# EAGLE design main (EAGLE 8.4.0)
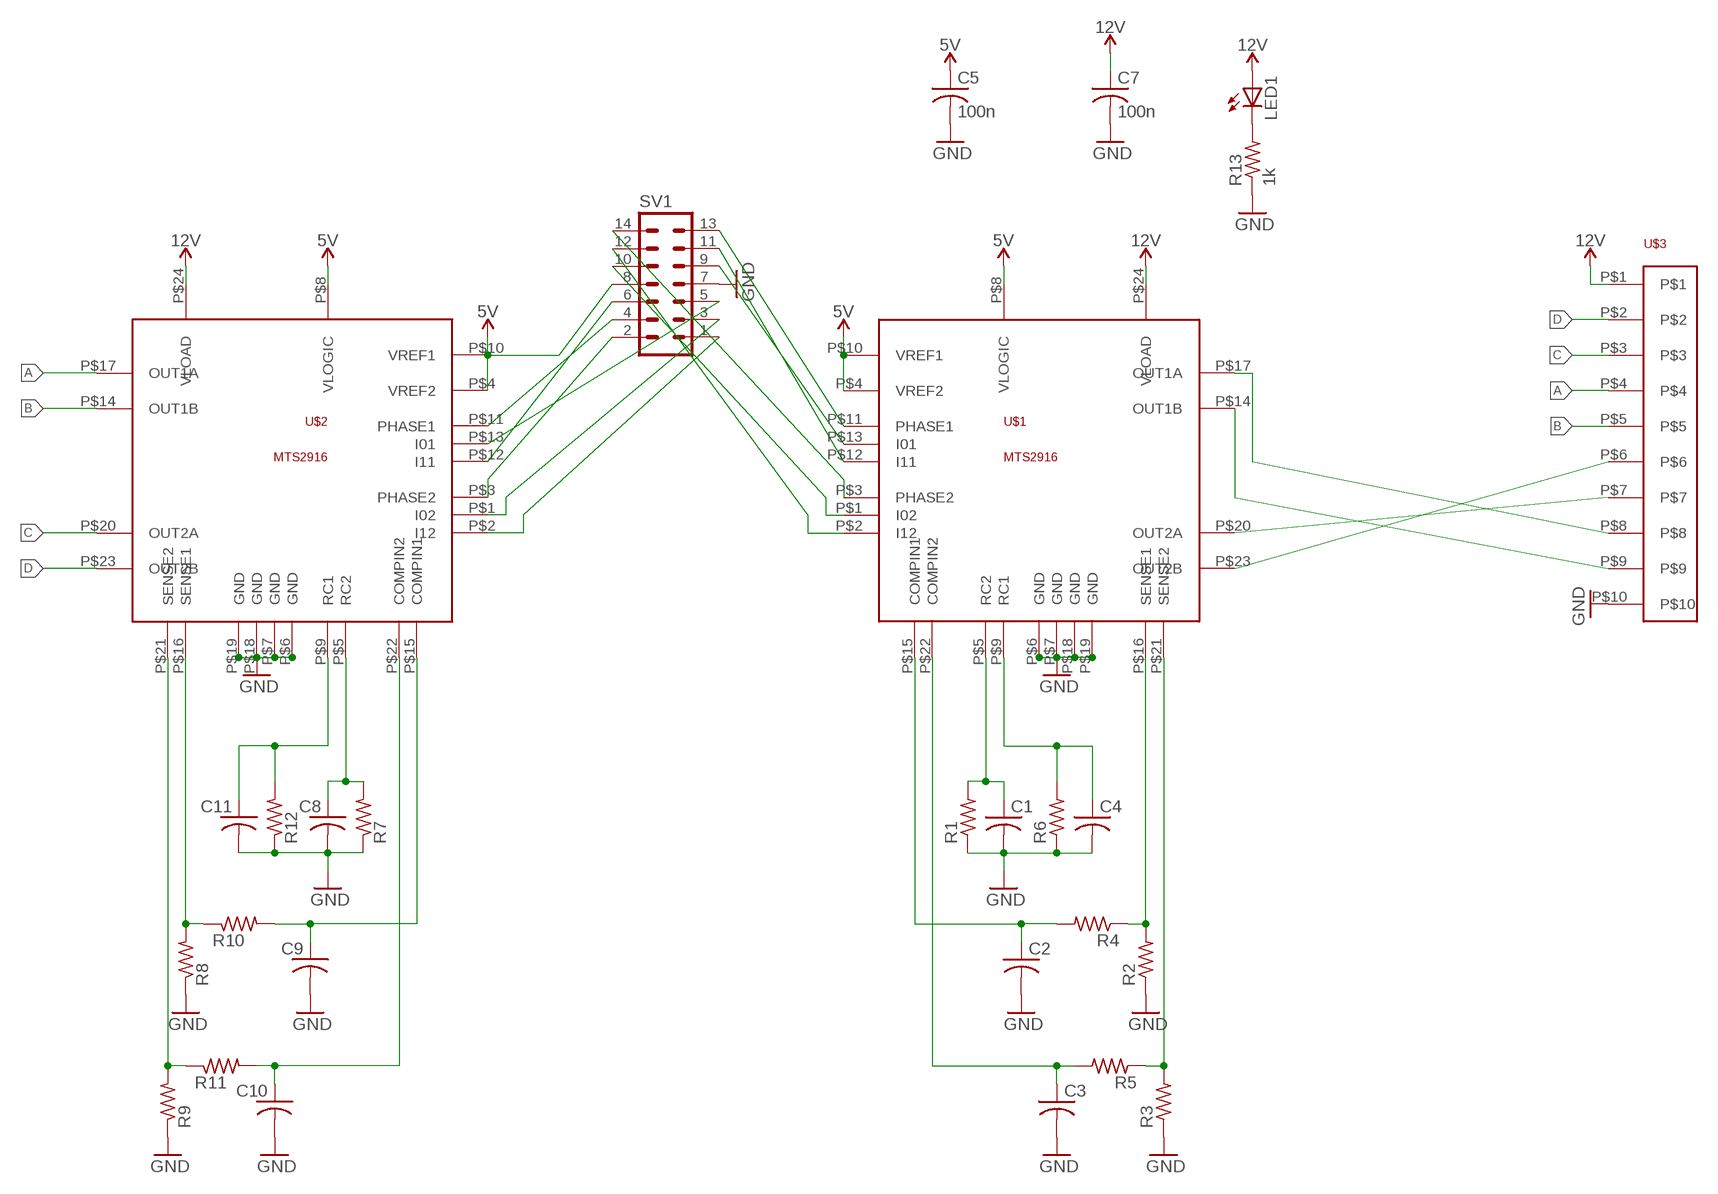
[diagram p0: schematic, sheet 1]

## Parts
C1  C-US025-024X044  [C025-024X044]
C2  C-US025-024X044  [C025-024X044]
C3  C-US025-024X044  [C025-024X044]
C4  C-US025-024X044  [C025-024X044]
C5  100n  C-USC0603  [C0603]
C7  100n  C-USC0603  [C0603]
C8  C-US025-024X044  [C025-024X044]
C9  C-US025-024X044  [C025-024X044]
C10  C-US025-024X044  [C025-024X044]
C11  C-US025-024X044  [C025-024X044]
LED1  LED_ESML0603  [LED_SML0603]
R1  R-US_M0805  [M0805]
R2  R-US_M0805  [M0805]
R3  R-US_M0805  [M0805]
R4  R-US_M0805  [M0805]
R5  R-US_M0805  [M0805]
R6  R-US_M0805  [M0805]
R7  R-US_M0805  [M0805]
R8  R-US_M0805  [M0805]
R9  R-US_M0805  [M0805]
R10  R-US_M0805  [M0805]
R11  R-US_M0805  [M0805]
R12  R-US_M0805  [M0805]
R13  1k  R-US_R0603  [R0603]
SV1  MA07-2  [MA07-2]
U$1  MTS2916  [SOP24]
U$2  MTS2916  [SOP24]
U$3  SCREWTERM_5MM_10WAY  [SCREWTERM_5MM_10WAY]

## Nets
5V: C5.1 SV1.8 U$1.P$4(VREF2) U$1.P$8(VLOGIC) U$1.P$10(VREF1) U$2.P$4(VREF2) U$2.P$8(VLOGIC) U$2.P$10(VREF1)
12V: C7.1 LED1.A U$1.P$24(VLOAD) U$2.P$24(VLOAD) U$3.P$1
A: U$2.P$17(OUT1A) U$3.P$4
B: U$2.P$14(OUT1B) U$3.P$5
C: U$2.P$20(OUT2A) U$3.P$3
D: U$2.P$23(OUT2B) U$3.P$2
GND: C1.2 C2.2 C3.2 C4.2 C5.2 C7.2 C8.2 C9.2 C10.2 C11.2 R1.1 R2.1 R3.1 R6.1 R7.1 R8.1 R9.1 R12.1 R13.1 SV1.7 U$1.P$6(GND) U$1.P$7(GND) U$1.P$18(GND) U$1.P$19(GND) U$2.P$6(GND) U$2.P$7(GND) U$2.P$18(GND) U$2.P$19(GND) U$3.P$10
N$1: U$1.P$23(OUT2B) U$3.P$6
N$2: R2.2 R4.1 U$1.P$16(SENSE1)
N$3: R3.2 R5.1 U$1.P$21(SENSE2)
N$4: C3.1 R5.2 U$1.P$22(COMPIN2)
N$5: C2.1 R4.2 U$1.P$15(COMPIN1)
N$6: R8.2 R10.1 U$2.P$16(SENSE1)
N$7: R9.2 R11.1 U$2.P$21(SENSE2)
N$8: C10.1 R11.2 U$2.P$22(COMPIN2)
N$9: C1.1 R1.2 U$1.P$5(RC2)
N$10: C4.1 R6.2 U$1.P$9(RC1)
N$11: C9.1 R10.2 U$2.P$15(COMPIN1)
N$12: C8.1 R7.2 U$2.P$5(RC2)
N$13: C11.1 R12.2 U$2.P$9(RC1)
N$14: SV1.13 U$1.P$11(PHASE1)
N$15: SV1.9 U$1.P$13(I01)
N$16: SV1.11 U$1.P$12(I11)
N$17: SV1.14 U$1.P$3(PHASE2)
N$18: SV1.10 U$1.P$1(I02)
N$19: SV1.12 U$1.P$2(I12)
N$20: SV1.4 U$2.P$11(PHASE1)
N$21: SV1.5 U$2.P$13(I01)
N$22: SV1.6 U$2.P$12(I11)
N$23: SV1.2 U$2.P$3(PHASE2)
N$24: SV1.3 U$2.P$1(I02)
N$25: SV1.1 U$2.P$2(I12)
N$26: U$1.P$20(OUT2A) U$3.P$7
N$27: U$1.P$14(OUT1B) U$3.P$9
N$28: U$1.P$17(OUT1A) U$3.P$8
N$29: LED1.C R13.2

## Library data of the parts
C1-C5 C7-C11 = adafruit:C-US: CAPACITOR, American symbol
LED1 = eagle-ltspice:LED_E: LED Source: http://www.osram.convergy.de Source: www.luxeon.com Source: www.kingbright.com; SPICEMODEL: NONE; SPICEPREFIX: D; SPICETYPE: diode
R1-R12 = adafruit:R-US_: RESISTOR, American symbol
R13 = resistor:R-US_: RESISTOR, American symbol
SV1 = con-lstb:MA07-2: PIN HEADER; OC_FARNELL: unknown; OC_NEWARK: unknown
U$1 U$2 = 7_segment_lib:MTS2916
U$3 = 7_segment_lib:SCREWTERM_5MM_10WAY

## Board
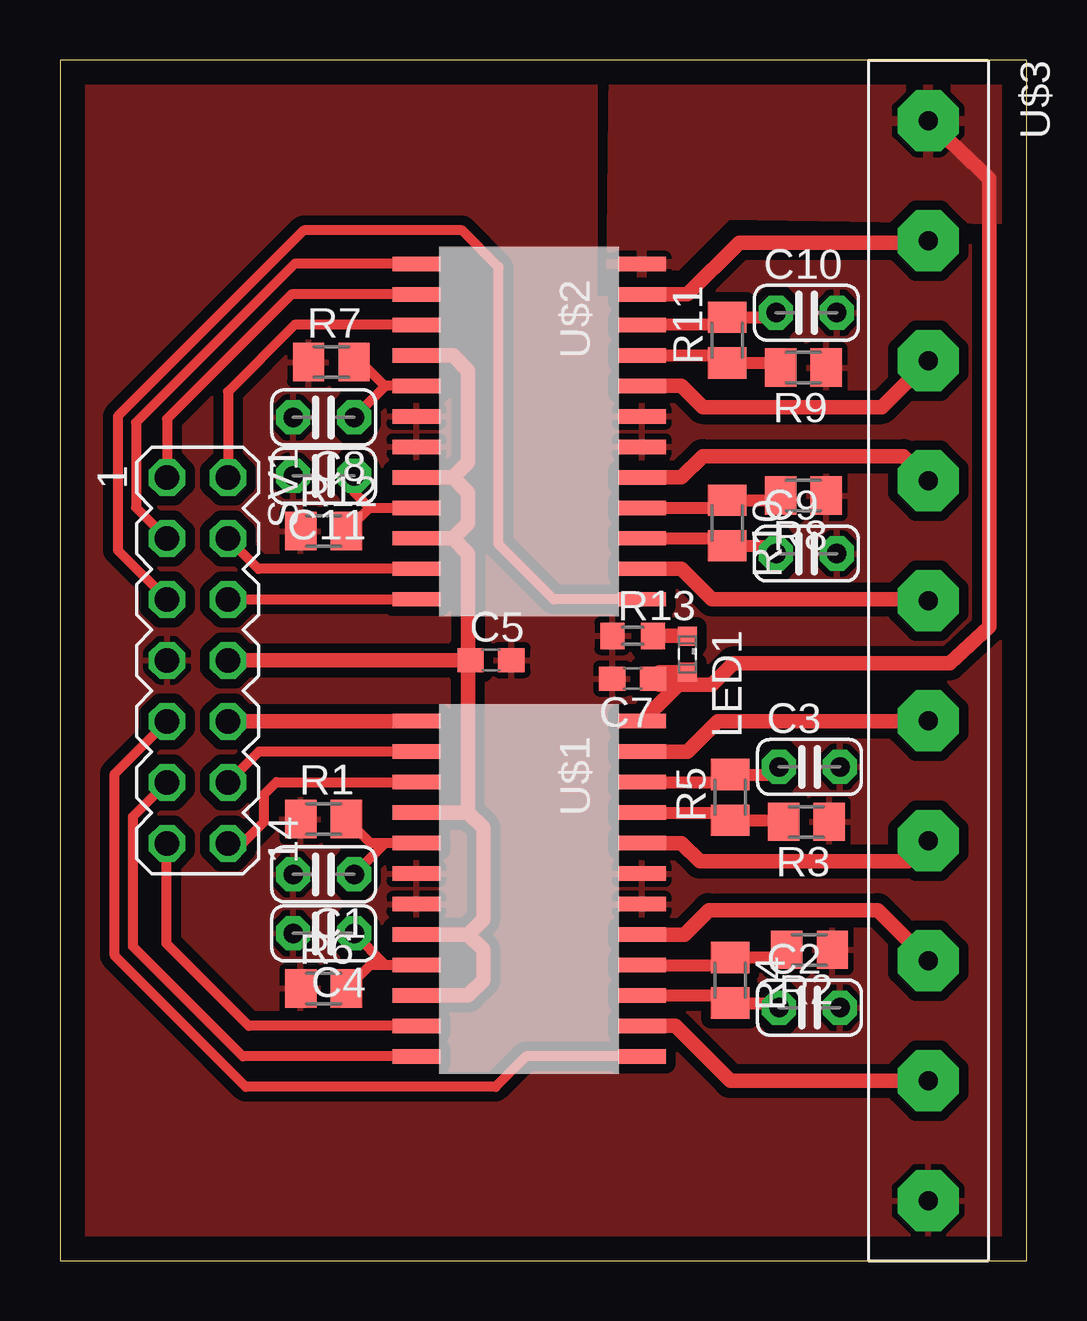
[diagram p1: board, top side]

Size 40.31 x 50.03 mm. Coordinates in mm from the lower left corner, seen from the top.
Outline: 0,0 40.31,0 40.31,50.03 0,50.03 0,0
Copper layers (1*16): Top 0.035mm / dielectric 1.5mm / Bottom 0.035mm
Design rules "default": minimum track width 6mil, minimum drill 0.35mm, track to track 6mil, track to pad 6mil, pad to pad 6mil, via to via 6mil, smd to smd 6mil, copper to edge 40mil, drill to drill 6mil, minimum pad ring 10mil, minimum via ring 8mil, stop-mask expansion 4mil, vias tented up to drill 0mil, thermal gap 10mil

### Footprints (pad centres in the part's own frame; a part is rotated, then mirrored left to right if it is on the bottom)
C025-024X044 = drill 0.813 pad 1.422 octagon: 1 -1.27,0; 2 1.27,0
C0603 = smd 1.1 x 1: 1 -0.85,0; 2 0.85,0
LED_SML0603 = smd 0.8 x 0.8: A 0.75,0; C -0.75,0
M0805 = smd 1.3 x 1.6: 1 -0.95,0; 2 0.95,0
R0603 = smd 1 x 1.1: 1 -0.85,0; 2 0.85,0
MA07-2 = drill 1.016 octagon: 1 -7.62,-1.27; 2 -7.62,1.27; 3 -5.08,-1.27; 4 -5.08,1.27; 5 -2.54,-1.27; 6 -2.54,1.27; 7 0,-1.27; 8 0,1.27; 9 2.54,-1.27; 10 2.54,1.27; 11 5.08,-1.27; 12 5.08,1.27; 13 7.62,-1.27; 14 7.62,1.27
SOP24 = smd 0.6 x 2: P$1 -6.985,-4.7; P$2 -5.715,-4.7; P$3 -4.445,-4.7; P$4 -3.175,-4.7; P$5 -1.905,-4.7; P$6 -0.635,-4.7; P$7 0.635,-4.7; P$8 1.905,-4.7; P$9 3.175,-4.7; P$10 4.445,-4.7; P$11 5.715,-4.7; P$12 6.985,-4.7; P$13 6.985,4.7; P$14 5.715,4.7; P$15 4.445,4.7; P$16 3.175,4.7; P$17 1.905,4.7; P$18 0.635,4.7; P$19 -0.635,4.7; P$20 -1.905,4.7; P$21 -3.175,4.7; P$22 -4.445,4.7; P$23 -5.715,4.7; P$24 -6.985,4.7
SCREWTERM_5MM_10WAY = drill 0.8 pad 2.54 octagon: P$1 0,0; P$2 5,0; P$3 10,0; P$4 15,0; P$5 20,0; P$6 25,0; P$7 30,0; P$8 35,0; P$9 40,0; P$10 45,0

### Placement (x,y rotation side)
C1  10.99,16.1 180 top
C2  31.24,10.54 0 top
C3  31.24,20.57 0 top
C4  10.99,13.64 180 top
C5  17.97,25.02 0 top
C7  23.88,24.26 180 top
C8  10.99,35.14 180 top
C9  31.11,29.46 0 top
C10  31.11,39.5 0 top
C11  10.99,32.7 180 top
LED1  26.16,25.27 270 top
R1  10.99,18.4 0 top
R2  31.24,12.95 180 top
R3  31.11,18.29 180 top
R4  27.94,11.68 270 top
R5  27.94,19.3 90 top
R6  10.99,11.34 0 top
R7  11.31,37.44 0 top
R8  30.99,31.88 180 top
R9  30.99,37.21 180 top
R10  27.81,30.73 270 top
R11  27.81,38.35 90 top
R12  10.99,30.4 0 top
R13  23.88,26.04 0 top
SV1  5.74,25.01 270 top
U$1  19.56,15.49 270 top
U$2  19.56,34.54 270 top
U$3  36.2,47.5 270 top

### Tracks (layer width: path | path; a pad name or v marks a point on that pad's centre or on a via)
5V
  Top 0.61: U$1.P$10 17.02,11.05 17.65,11.68 17.65,12.95 17.02,13.59 | 17.02,13.59 U$1.P$8 | U$1.P$4 17.02,18.67 | 17.02,18.67 17.65,18.03 17.65,14.22 17.02,13.59 | U$2.P$4 16.38,37.72 17.02,37.08 17.02,33.27 16.38,32.64 | 16.38,32.64 U$2.P$8 | U$2.P$10 16.38,30.1 | 16.38,30.1 17.02,30.73 17.02,32 16.38,32.64 | 16.38,30.1 17.02,29.46 17.02,25.12 C5.1 17.02,24.92 | 17.02,18.67 17.02,24.92 | SV1.8 16.93,25.01 17.02,24.92
12V
  Top 0.61: U$3.P$1 38.73,45.08 38.73,26.42 37.08,24.89 28.07,24.89 27.18,24 25.78,24 | 25.78,24 U$1.P$24 | 25.78,24 24.98,24 C7.1 24.99,24.52 LED1.A
  pour Top (isolate 0.406): 22.99,41.02 23.11,51.31 43.05,51.43 43.18,43.31 27.81,43.56 25.27,41.02
A
  Top 0.61: U$2.P$17 25.91,32.64 26.8,33.53 35.16,33.53 U$3.P$4
B
  Top 0.61: U$2.P$14 25.91,28.83 27.18,27.56 36.13,27.56 U$3.P$5
C
  Top 0.61: U$2.P$20 25.91,36.45 26.8,35.56 34.26,35.56 U$3.P$3
D
  Top 0.61: U$2.P$23 26.16,40.26 28.32,42.42 36.12,42.42 U$3.P$2
GND
  pour Top (isolate 0.406): -3.94,-2.79 41.4,-1.02 41.66,41.27 41.66,42.29 28.19,42.29 26.16,40.26 26.16,40.13 22.35,40.13 22.35,51.43 -4.57,51.56
N$1
  Top 0.61: U$1.P$23 26.16,21.21 27.43,22.48 36.18,22.48 U$3.P$6
N$2
  Top 0.508: U$1.P$16 27.62,12.32 R4.1 29.97,12.63 R2.2
N$3
  Top 0.508: U$1.P$21 27.62,18.67 R5.1 30.1,18.35 R3.2
N$4
  Top 0.508: U$1.P$22 27.62,19.94 R5.2 29.65,20.25 C3.1
N$5
  Top 0.508: U$1.P$15 27.62,11.05 R4.2 29.78,10.73 C2.1
N$6
  Top 0.508: U$2.P$16 27.5,31.37 R10.1 29.84,31.68 R8.2
N$7
  Top 0.508: U$2.P$21 27.5,37.72 R11.1 29.84,37.4 R9.2
N$8
  Top 0.508: U$2.P$22 27.5,38.99 R11.2 29.65,39.3 C10.1
N$9
  Top 0.406: U$1.P$5 13.56,17.4 | 13.56,17.4 C1.1 | 13.56,17.4 12.94,17.4 R1.2
N$10
  Top 0.406: U$1.P$9 13.58,12.32 | 13.58,12.32 C4.1 | 13.58,12.32 12.92,12.32 R6.2
N$11
  Top 0.508: U$2.P$15 27.5,30.1 R10.2 29.52,29.78 C9.1
N$12
  Top 0.406: U$2.P$5 13.57,36.45 13.55,36.43 | 13.55,36.43 C8.1 | R7.2 12.55,37.44 13.55,36.43
N$13
  Top 0.406: 12.91,31.37 U$2.P$9 | 12.91,31.37 R12.2 | C11.1 12.26,32.02 12.91,31.37
N$14
  Top 0.406: U$1.P$11 7.87,9.78 4.45,13.21 4.45,17.37 SV1.13
N$15
  Top 0.406: U$1.P$13 19.43,8.51 18.16,7.24 7.75,7.24 2.29,12.7 2.29,20.29 SV1.9
N$16
  Top 0.406: U$1.P$12 7.62,8.51 3.05,13.08 3.05,18.51 SV1.11
N$17
  Top 0.406: SV1.14 7.61,17.39 8.51,18.29 8.51,19.43 9.02,19.94 U$1.P$3
N$18
  Top 0.61: U$1.P$1 7.01,22.48 SV1.10
N$19
  Top 0.406: U$1.P$2 8.29,21.21 SV1.12
N$20
  Top 0.406: U$2.P$11 8.27,28.83 SV1.4
N$21
  Top 0.406: U$2.P$13 20.57,27.56 18.29,29.84 18.29,41.4 16.76,42.93 10.16,42.93 2.41,35.18 2.41,29.6 SV1.5
N$22
  Top 0.406: SV1.6 14.85,27.55 U$2.P$12
N$23
  Top 0.406: U$2.P$3 9.78,38.99 7,36.21 SV1.2
N$24
  Top 0.406: U$2.P$1 9.78,41.53 3.17,34.92 3.17,31.38 SV1.3
N$25
  Top 0.406: U$2.P$2 9.65,40.26 4.46,35.07 SV1.1
N$26
  Top 0.61: U$1.P$20 25.91,17.4 26.67,16.64 35.33,16.64 U$3.P$7
N$27
  Top 0.61: U$1.P$14 25.65,9.78 27.94,7.49 U$3.P$9
N$28
  Top 0.61: U$1.P$17 26.04,13.59 27.05,14.61 34.09,14.61 U$3.P$8
N$29
  Top 0.61: R13.2 LED1.C